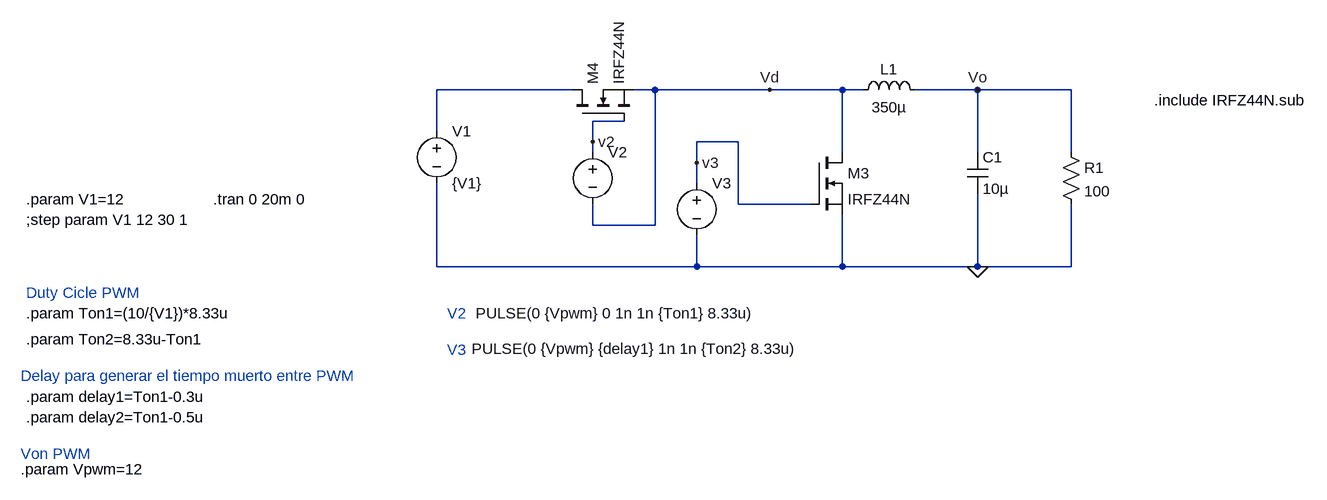
[diagram p0: schematic buck_nmos.asc]
buck_nmos.asc, the LTspice schematic file:
Version 4.1
SHEET 1 1364 732
WIRE 240 48 32 48
WIRE 368 48 336 48
WIRE 544 48 368 48
WIRE 656 48 544 48
WIRE 688 48 656 48
WIRE 864 48 768 48
WIRE 1008 48 864 48
WIRE 320 96 272 96
WIRE 32 112 32 48
WIRE 272 128 272 96
WIRE 496 128 432 128
WIRE 272 144 272 128
WIRE 656 144 656 48
WIRE 864 144 864 48
WIRE 1008 144 1008 48
WIRE 432 160 432 128
WIRE 432 192 432 160
WIRE 496 224 496 128
WIRE 608 224 496 224
WIRE 272 256 272 224
WIRE 368 256 368 48
WIRE 368 256 272 256
WIRE 32 320 32 192
WIRE 432 320 432 272
WIRE 432 320 32 320
WIRE 656 320 656 240
WIRE 656 320 432 320
WIRE 864 320 864 208
WIRE 864 320 656 320
WIRE 1008 320 1008 224
WIRE 1008 320 864 320
FLAG 864 320 0
FLAG 864 48 Vo
FLAG 544 48 Vd
FLAG 272 128 v2
FLAG 432 160 v3
SYMBOL voltage 32 96 R0
WINDOW 123 0 0 Left 0
WINDOW 39 0 0 Left 0
SYMATTR InstName V1
SYMATTR Value {V1}
SYMBOL voltage 272 128 R0
WINDOW 3 -180 264 Left 2
WINDOW 123 0 0 Left 0
WINDOW 39 0 0 Left 0
SYMATTR Value PULSE(0 {Vpwm} 0 1n 1n {Ton1} 8.33u)
SYMATTR InstName V2
SYMBOL ind 672 64 R270
WINDOW 0 32 56 VTop 2
WINDOW 3 5 56 VBottom 2
SYMATTR InstName L1
SYMATTR Value 350µ
SYMBOL cap 848 144 R0
SYMATTR InstName C1
SYMATTR Value 10µ
SYMBOL res 992 128 R0
SYMATTR InstName R1
SYMATTR Value 100
SYMBOL voltage 432 176 R0
WINDOW 123 0 0 Left 0
WINDOW 39 0 0 Left 0
WINDOW 3 -346 270 Left 2
SYMATTR Value PULSE(0 {Vpwm} {delay1} 1n 1n {Ton2} 8.33u)
SYMATTR InstName V3
SYMBOL nmos 608 144 R0
SYMATTR InstName M3
SYMATTR Value IRFZ44N
SYMBOL nmos 240 96 R270
SYMATTR InstName M4
SYMATTR Value IRFZ44N
TEXT -312 216 Left 2 !.tran 0 20m 0
TEXT -600 248 Left 2 !;step param V1 12 30 1
TEXT -600 392 Left 2 !.param Ton1=(10/{V1})*8.33u
TEXT -600 216 Left 2 !.param V1=12
TEXT -600 552 Left 2 !.param delay2=Ton1-0.5u
TEXT -600 520 Left 2 !.param delay1=Ton1-0.3u
TEXT -608 632 Left 2 !.param Vpwm=12
TEXT 1136 64 Left 2 !.include IRFZ44N.sub
TEXT -600 432 Left 2 !.param Ton2=8.33u-Ton1
TEXT -608 488 Left 2 ;Delay para generar el tiempo muerto entre PWM
TEXT -600 360 Left 2 ;Duty Cicle PWM
TEXT -608 608 Left 2 ;Von PWM
TEXT 48 392 Left 2 ;V2
TEXT 48 448 Left 2 ;V3

The netlist it stands for:
* buck_nmos.asc
V1 N001 0 {V1}
V2 v2 Vd PULSE(0 {Vpwm} 0 1n 1n {Ton1} 8.33u)
L1 Vd Vo 350µ
C1 Vo 0 10µ
R1 Vo 0 100
V3 v3 0 PULSE(0 {Vpwm} {delay1} 1n 1n {Ton2} 8.33u)
M3 Vd v3 0 0 IRFZ44N
M4 N001 v2 Vd Vd IRFZ44N
.model NMOS NMOS
.model PMOS PMOS
.lib standard.mos
.tran 0 20m 0
;step param V1 12 30 1
.param Ton1=(10/{V1})*8.33u
.param V1=12
.param delay2=Ton1-0.5u
.param delay1=Ton1-0.3u
.param Vpwm=12
.include IRFZ44N.sub
.param Ton2=8.33u-Ton1
* Delay para generar el tiempo muerto entre PWM
* Duty Cicle PWM
* Von PWM
* V2
* V3
.backanno
.end